# EAGLE design rev-polarity-deflector-dish-mk-2.0 (EAGLE 7.5.0)
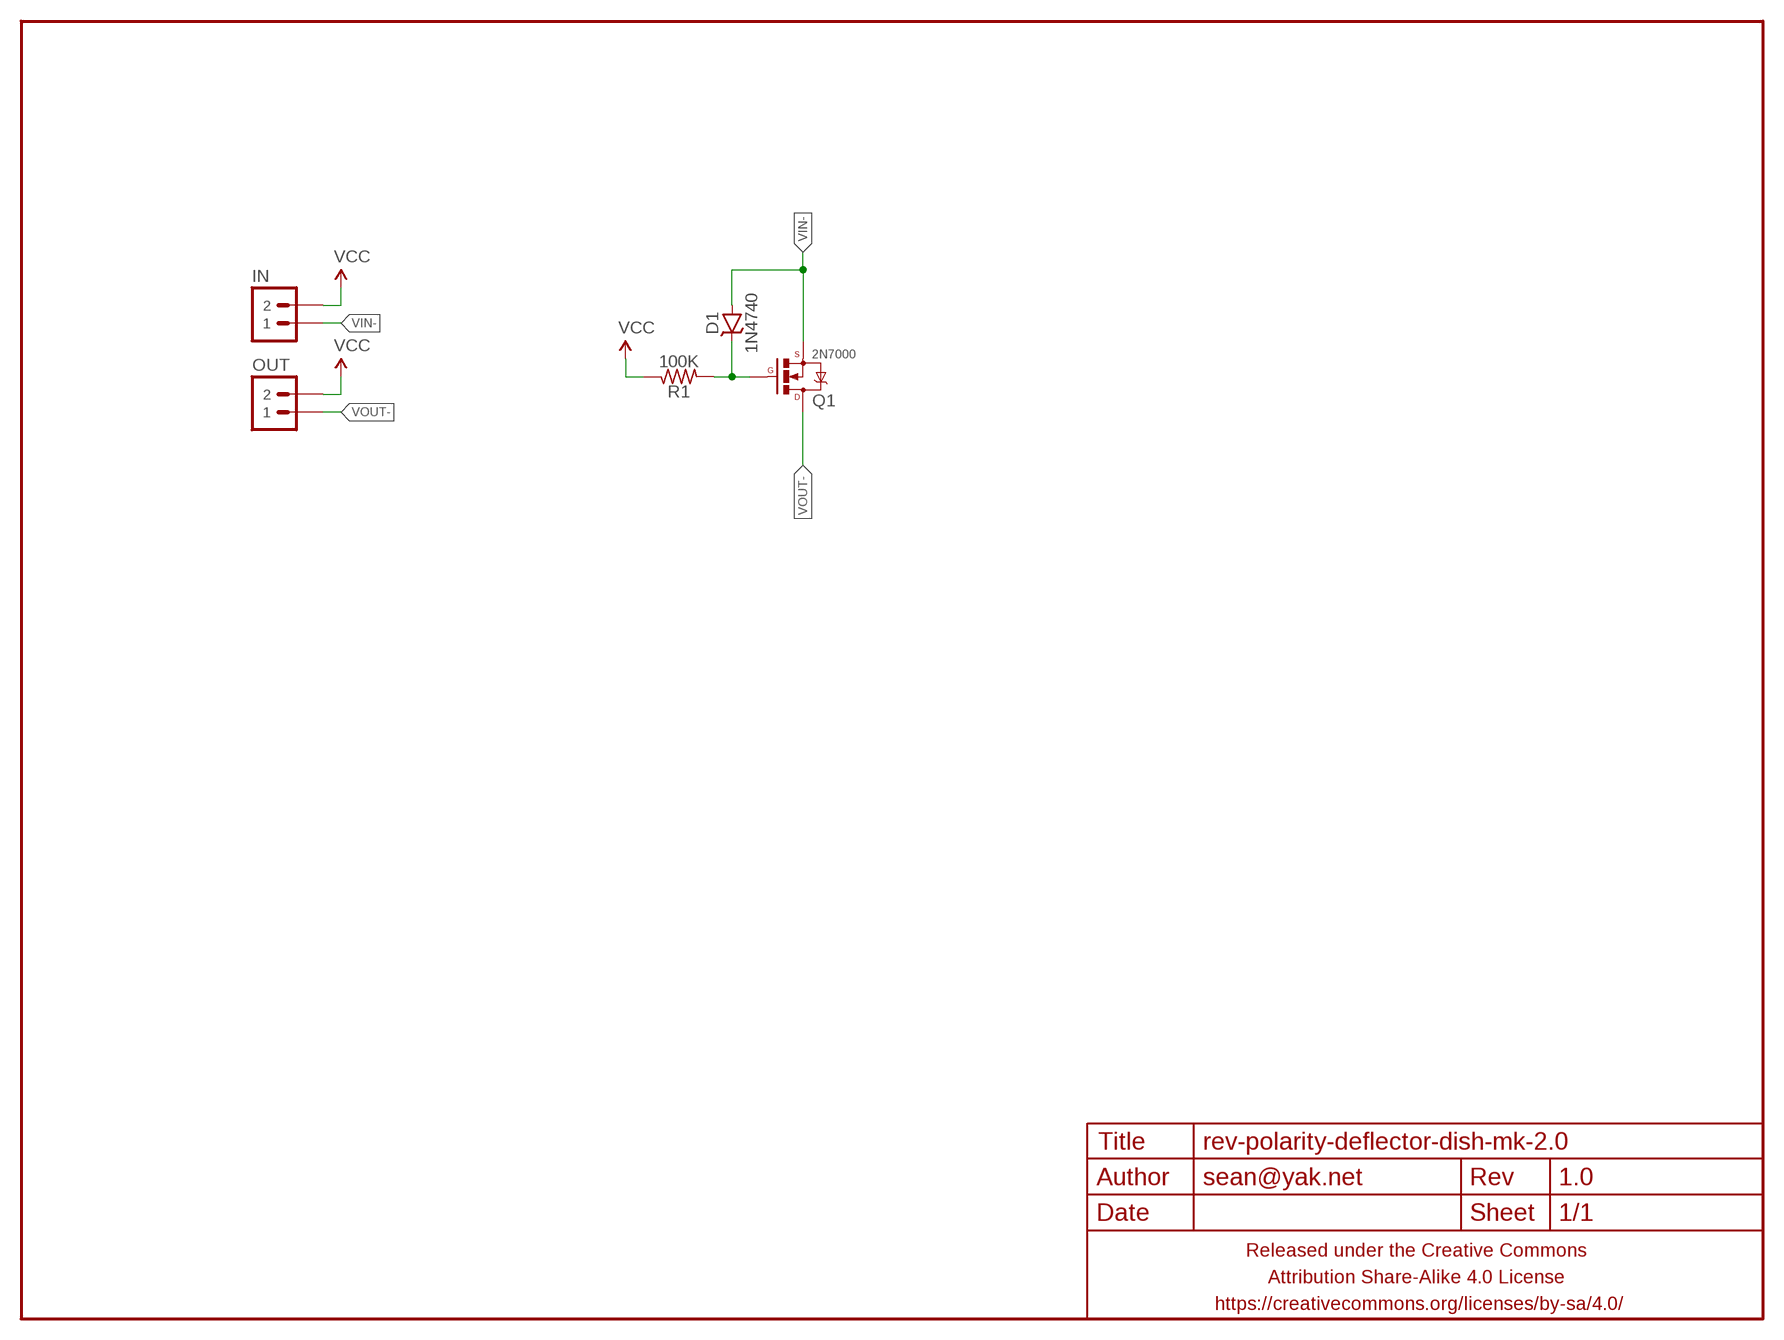
[diagram p0: schematic, sheet 1]

## Parts
D1  1N4740  DIODE-ZENERSOT23  [SOT23]
FRAME1  FRAME-LETTERNO_PACKAGE  [DUMMY]
IN  M02PTH-CENTERED  [1X02-CENTER]
OUT  M02PTH-CENTERED  [1X02-CENTER]
Q1  2N7000  MOSFET-NCHANNELIRLML2502  [SOT23]
R1  100K  RESISTORR0603  [R0603]

## Nets
N$1: D1.3(C) Q1.1(G) R1.2
VCC: IN.2 OUT.2 R1.1
VIN-: D1.1(A) D1.2(A) IN.1 Q1.2(S)
VOUT-: OUT.1 Q1.3(D)

## Library data of the parts
D1 = a_parts:DIODE-ZENER: Zener Diode Production Part - 8199 3.4V Zener Voltage
FRAME1 = A_butts:FRAME-LETTER: Schematic Frame Standard 8.5x11 US Letter frame; DESIGNER: sean@yak.net; VERSION: 1.0
IN OUT = a_parts:M02: Standard 2-pin 0.1" header. Use with - straight break away headers ( PRT-00116) - right angle break away headers (PRT-00553) - swiss pins (PRT-00743) - machine pins (PRT-00117) - female headers (PRT-00115) Molex polarized connector foot print use with: PRT-08233 with associated crimp pins and housings. 2.54_SCREWTERM for use with PRT-10571. 3.5mm Screw Terminal footprints for PRT-08084 5mm Screw Terminal footprints for use with PRT-08433
Q1 = a_parts:MOSFET-NCHANNEL: Common NMOSFET Parts MFG P/N Store ID Prod ID FDD8780 TRANS-09984 SI7820DN TRANS-11055 FDS6630A IC-08089 2N7002PW TRANS-11151 FQP30N06L COM-10213 TRANS-10060 BSS123LT1G TRANS-08345 BSS138 TRANS-00830 BS170 2N7000
R1 = a_parts:RESISTOR: RESISTOR, American symbol

## Board
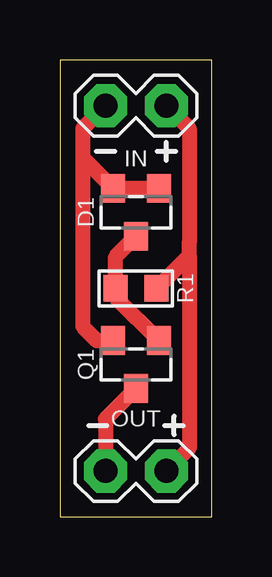
[diagram p1: board, top side]

Size 6.35 x 19.05 mm. Coordinates in mm from the lower left corner, seen from the top.
Outline: 0,19.05 0,0 6.35,0 6.35,19.05 0,19.05
Copper layers (1*16): Top 0.0356mm / dielectric 1.5011mm / Bottom 0.0356mm
Design rules "LaenPCBOrder2": minimum track width 6mil, minimum drill 13mil, track to track 6mil, track to pad 6mil, pad to pad 6mil, via to via 6mil, smd to smd 6mil, copper to edge 15mil, drill to drill 6mil, minimum pad ring 7mil, minimum via ring 7mil, stop-mask expansion 3mil, vias tented up to drill 20mil, thermal gap 10mil

### Footprints (pad centres in the part's own frame; a part is rotated, then mirrored left to right if it is on the bottom)
SOT23 = smd 1 x 1.2: 1 -0.95,-1; 2 0.95,-1; 3 0,1
1X02-CENTER = drill 1 pad 1.8 octagon: 1 -1.27,0; 2 1.27,0
R0603 = smd 1 x 1.1: 1 -0.85,0; 2 0.85,0

### Placement (x,y rotation side)
D1  3.17,12.7 180 top
FRAME1  0.64,0.64 0 top
IN  3.17,17.14 0 top
OUT  3.17,1.91 0 top
Q1  3.17,6.35 180 top
R1  3.17,9.53 180 top

### Tracks (layer width: path | path; a pad name or v marks a point on that pad's centre or on a via)
N$1
  Top 0.635: D1.3 2.33,10.85 R1.2 2.33,9.15 Q1.1
VCC
  Top 0.635: IN.2 5.4,16.19 5.4,11.43 5.4,10.9 | 5.4,10.9 5.4,2.86 OUT.2 | R1.1 5.4,10.9
VIN-
  Top 0.635: IN.1 0.95,16.19 0.95,14.97 | 0.95,14.97 0.95,7.94 1.54,7.35 Q1.2 | 0.95,14.97 D1.2 D1.1
VOUT-
  Top 0.635: Q1.3 1.91,4.08 OUT.1